# Altium schematic sheet OV2640.SchDoc
size A
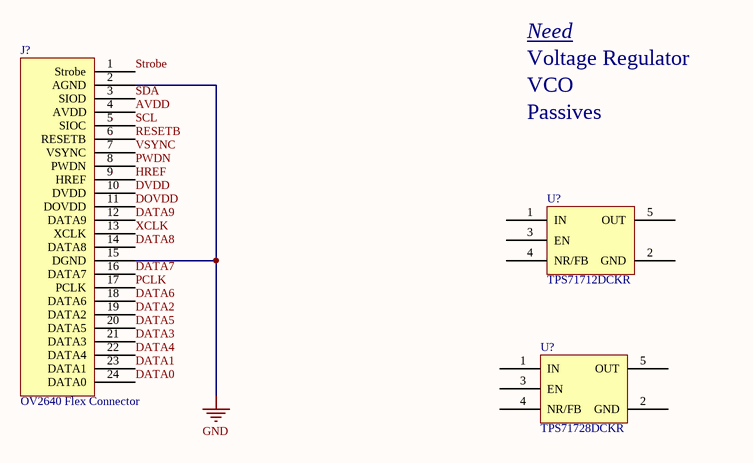
[diagram p0: OV2640.SchDoc]

## Parts
(Parts that share a designator on the sheet are numbered #1, #2 ... from top to bottom, then left to right.)
J?  OV2640 Flex Connector  [FFC_24]
U?#1  TPS71712DCKR
U?#2  TPS71728DCKR

## Nets
GND: J?.2(AGND) J?.15(DGND)
AVDD: J?.4(AVDD)
DATA0: J?.24(DATA0)
DATA1: J?.23(DATA1)
DATA2: J?.19(DATA2)
DATA3: J?.21(DATA3)
DATA4: J?.22(DATA4)
DATA5: J?.20(DATA5)
DATA6: J?.18(DATA6)
DATA7: J?.16(DATA7)
DATA8: J?.14(DATA8)
DATA9: J?.12(DATA9)
DOVDD: J?.11(DOVDD)
DVDD: J?.10(DVDD)
HREF: J?.9(HREF)
PCLK: J?.17(PCLK)
PWDN: J?.8(PWDN)
RESETB: J?.6(RESETB)
SCL: J?.5(SIOC)
SDA: J?.3(SIOD)
Strobe: J?.1(Strobe)
VSYNC: J?.7(VSYNC)
XCLK: J?.13(XCLK)

Not connected (* = marked no-connect by the designer): U?#1 1(IN) 2(GND) 3(EN) 4(NR/FB) 5(OUT); U?#2 1(IN) 2(GND) 3(EN) 4(NR/FB) 5(OUT)

## Notes on the sheet
- Need
- Voltage Regulator
- VCO
- Passives

## Library data of the parts
J? = 0524372433: CONN FFC BOTTOM 24POS 0.50MM R/A; Manufacturer: Molex, LLC; Flat Flex Type: FFC, FPC; Connector/Contact Type: Contacts, Bottom; Number of Positions: 24; Pitch: 0.020" (0.50mm); FFC, FCB Thickness: 0.30mm; Locking Feature: Slide Lock; Cable End Type: Straight, Tapered; Actuator Material: Polyphenylene Sulfide (PPS), Glass Filled; Voltage Rating: 50V; Material Flammability Rating: UL94 V-0; Current Rating: 0.5A; Supplier 1: Digi-Key; Manufacturer Part Number: 0524372433; RoHS: RoHS Compliant; Category: Connectors, Interconnects; Stock 1: 153; Pricing 1: 1=2.39, 10=2.164, 25=2.032, 50=1.9436, 100=1.8552, 250=1.67848, 500=1.54596 (USD); Packaging: Cut Tape (CT); Mounting Type: Surface Mount, Right Angle; Termination: Solder; Height Above Board: 0.079" (2.00mm); Contact Material: Phosphor Bronze; Contact Finish: Tin Bismuth; Housing Material: Polyamide (PA), Nylon, Glass Filled; Features: Solder Retention, Zero Insertion Force (ZIF); Operating Temperature: -40°C ~ 85°C; ComponentLink1URL: http://www.molex.com/pdm_docs/sd/524372433_sd.pdf; ComponentLink1Description: http://www.molex.com/pdm_docs/sd/524372433_sd.pdf; Supplier Part Number 1: WM10976CT-ND
U?#1 = TPS71712DCKR: IC REG LDO 1.2V 0.15A SC70-5; Manufacturer: Texas Instruments; Regulator Topology: Positive Fixed; Current - Output: 150mA; Number of Regulators: 1; Voltage - Input: 2.5 V ~ 6.5 V; Current - Limit (Min): 200mA; Supplier 1: Digi-Key; Manufacturer Part Number: TPS71712DCKR; RoHS: RoHS Compliant; Category: Integrated Circuits (ICs); Stock 1: 19077; Pricing 1: 1=1.1, 10=0.985, 100=0.7679, 500=0.63504, 1000=0.405 (USD); Packaging: Cut Tape (CT); Voltage - Output: 1.2V; Voltage - Dropout (Typical): -; Operating Temperature: -40°C ~ 125°C; Mounting Type: Surface Mount; Package / Case: 5-TSSOP, SC-70-5, SOT-353; Supplier Device Package: SC-70-5; ComponentLink1URL: http://www.ti.com/lit/ds/symlink/tps717.pdf; ComponentLink1Description: http://www.ti.com/lit/ds/symlink/tps717.pdf; Supplier Part Number 1: 296-22480-1-ND
U?#2 = TPS71728DCKR: IC REG LDO 2.8V 0.15A SC70-5; Manufacturer: Texas Instruments; Regulator Topology: Positive Fixed; Current - Output: 150mA; Voltage - Dropout (Typical): 0.17V @ 150mA; Number of Regulators: 1; Voltage - Input: Up to 6.5V; Current - Limit (Min): 200mA; Supplier 1: Digi-Key; Manufacturer Part Number: TPS71728DCKR; RoHS: RoHS Compliant; Category: Integrated Circuits (ICs); Stock 1: 2440; Pricing 1: 1=1.1, 10=0.985, 100=0.7679, 500=0.63504, 1000=0.405 (USD); Packaging: Cut Tape (CT); Voltage - Output: 2.8V; Operating Temperature: -40°C ~ 125°C; Mounting Type: Surface Mount; Package / Case: 5-TSSOP, SC-70-5, SOT-353; Supplier Device Package: SC-70-5; ComponentLink1URL: http://www.ti.com/lit/ds/symlink/tps717.pdf; ComponentLink1Description: http://www.ti.com/lit/ds/symlink/tps717.pdf; Supplier Part Number 1: 296-19650-1-ND